# Altium schematic sheet MAX485.SchDoc
size A
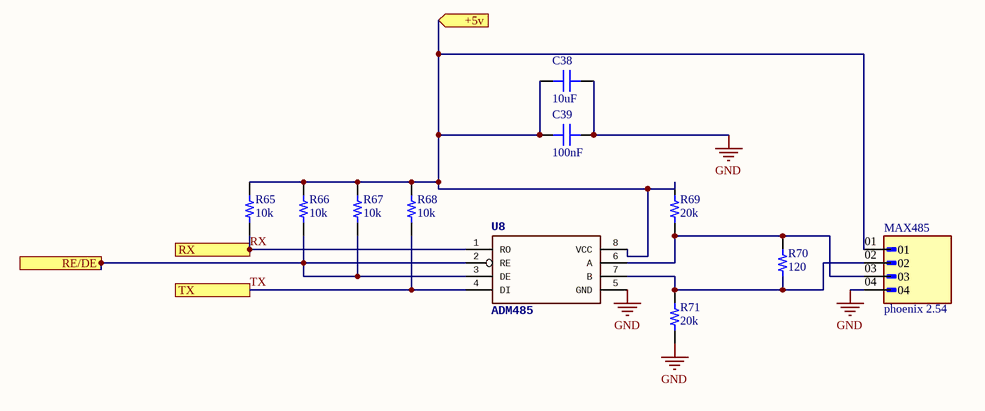
[diagram p0: MAX485.SchDoc]

## Parts
C38  10uF  [CAP 0805_2012]
C39  100nF  [CAP 0805_2012]
MAX485  phoenix 2.54  [PHOENIX_1881574]
R65  10k  [RES 0805_2012]
R66  10k  [RES 0805_2012]
R67  10k  [RES 0805_2012]
R68  10k  [RES 0805_2012]
R69  20k  [RES 0805_2012]
R70  120  [RES 0805_2012]
R71  20k  [RES 0805_2012]
U8  ADM485  [SOIC-8 4.9X3.9MM P1.27MM]

## Ports
+5v (in), RE/DE, RX, TX

## Nets
GND: C38.2 C39.2 MAX485.04 R71.1 U8.5(GND)
+5v: C38.1 C39.1 MAX485.01 R65.2 R66.2 R67.2 R68.2 R69.2 U8.8(VCC) ; port +5v
RE/DE: R66.1 R67.1 U8.2(RE) U8.3(DE) ; port RE/DE
RX: R65.1 U8.1(RO) ; port RX
TX: R68.1 U8.4(DI) ; port TX
NetMAX485_02: MAX485.02 R70.1 R71.2 U8.7(B)
NetMAX485_03: MAX485.03 R69.1 R70.2 U8.6(A)

## Library data of the parts
C38 = Cap 0805: SMT Capacitor; VALUE: 100nF
C39 = Cap 0805: SMT Capacitor; VALUE: 100nF
MAX485 = 1881574: MF: {'manufacturer': u'Phoenix Contact'}; Package: None; Price: None; Value: *; MP: 1881574; Availability: Unavailable
R65-R71 = Res 0805: SMT Resistor; VALUE: 1K
U8 = ADM485 (SMD): RS485 Interface; PartNumber: ADM4853ARZ-REEL7